# Altium project nrf7002_qfaa.PrjPCB
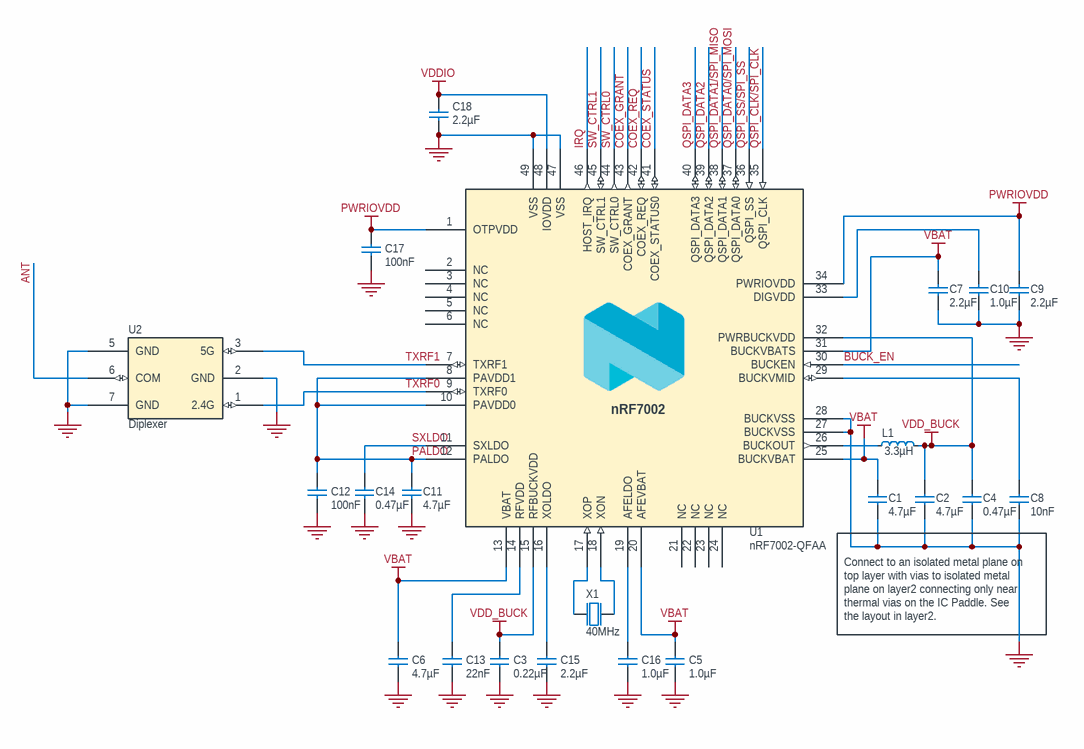
[diagram p0: nrf7002_qfaa.SchDoc]
Classification: PUBLIC; Device: nRF7002; RefLayoutTitle: nRF7002 Reference Layout; Revision: 1.1
1 sheet, 22 parts. Net scope: global (net labels, ports and power ports of the same name join across sheets).
Board file: nrf7002_qfaa.PcbDoc

## Sheet nrf7002_qfaa.SchDoc
size A4; PCAName: nRF7002 Reference Layout; BoardTitle: nRF7002 Reference Layout; Organization: Nordic Semiconductor; Revision: 1.1; SheetNumber: 1; SheetTotal: 1; DrawnBy: PRBU; DocumentSize: A4; RefLayoutTitle: nRF7002 Reference Layout; ProjectName: nrf7002_qfaa.PrjPCB

### Parts
C1  4.7µF  [CAPC1608X06L]
C2  4.7µF  [CAPC1608X06L]
C3  0.22µF  [CAPC0603X03L_C]
C4  0.47µF  [CAPC0603X03L_C]
C5  1.0µF  [CAPC1005X04L]
C6  4.7µF  [CAPC1608X06L]
C7  2.2µF  [CAPC1608X06L]
C8  10nF  [CAPC0603X03L_C]
C9  2.2µF  [CAPC1005X04L]
C10  1.0µF  [CAPC1005X04L]
C11  4.7µF  [CAPC1608X06L]
C12  100nF  [CAPC0603X03L_C]
C13  22nF  [CAPC0603X03L_C]
C14  0.47µF  [CAPC0603X03L_C]
C15  2.2µF  [CAPC0603X03L_C]
C16  1.0µF  [CAPC1005X04L]
C17  100nF  [CAPC0603X03L_C]
C18  2.2µF  [CAPC1608X06L]
L1  3.3µH  [INDC2520X10N]
U1  nRF7002-QFAA  [QFN40P600X600X60-48N]
U2  Diplexer  [CAF-50P160X80-6N]
X1  40MHz  [BT-XTAL_1612]

### Nets
GND: C1.1 C2.1 C3.1 C4.1 C5.1 C6.1 C7.1 C8.2 C9.1 C10.2 C11.1 C12.2 C13.1 C14.1 C15.1 C16.1 C17.1 C18.1 U1.27(BUCKVSS) U1.28(BUCKVSS) U1.47(VSS) U1.49(VSS) U2.2(GND) U2.5(GND) U2.7(GND) X1.2(GND) X1.4(GND)
PWRIOVDD: C9.2 C17.2 U1.1(OTPVDD) U1.34(PWRIOVDD)
VBAT: C1.2 C5.2 C6.2 C7.2 U1.13(VBAT) U1.20(AFEVBAT) U1.25(BUCKVBAT) U1.31(BUCKVBATS)
VDD_BUCK: C2.2 C3.2 C4.2 L1.2 U1.15(RFBUCKVDD) U1.32(PWRBUCKVDD)
VDDIO: C18.2 U1.48(IOVDD)
ANT: U2.6(COM)
BUCK_EN: U1.30(BUCKEN)
COEX_GRANT: U1.43(COEX_GRANT)
COEX_REQ: U1.42(COEX_REQ)
COEX_STATUS: U1.41(COEX_STATUS0)
IRQ: U1.46(HOST_IRQ)
PALDO: C11.2 C12.1 U1.8(PAVDD1) U1.10(PAVDD0) U1.12(PALDO)
QSPI_CLK/SPI_CLK: U1.35(QSPI_CLK)
QSPI_DATA0/SPI_MOSI: U1.37(QSPI_DATA0)
QSPI_DATA1/SPI_MISO: U1.38(QSPI_DATA1)
QSPI_DATA2: U1.39(QSPI_DATA2)
QSPI_DATA3: U1.40(QSPI_DATA3)
QSPI_SS/SPI_SS: U1.36(QSPI_SS)
SW_CTRL0: U1.44(SW_CTRL0)
SW_CTRL1: U1.45(SW_CTRL1)
SXLDO: C14.2 U1.11(SXLDO)
TXRF0: U1.9(TXRF0) U2.1(2.4G)
TXRF1: U1.7(TXRF1) U2.3(5G)
NetC8_1: C8.1 U1.29(BUCKVMID)
NetC10_1: C10.1 U1.33(DIGVDD)
NetC13_2: C13.2 U1.14(RFVDD)
NetC15_2: C15.2 U1.16(XOLDO)
NetC16_2: C16.2 U1.19(AFELDO)
NetL1_1: L1.1 U1.26(BUCKOUT)
NetU1_17: U1.17(XOP) X1.3(out)
NetU1_18: U1.18(XON) X1.1(inp)

Not connected (* = marked no-connect by the designer): U1 2(NC) 3(NC) 4(NC) 5(NC) 6(NC) 21(NC) 22(NC) 23(NC) 24(NC)

### Notes on the sheet
- Connect to an isolated metal plane on top layer with vias to isolated metal plane on layer2 connecting only near thermal vias on the IC Paddle. See the layout in layer2.
- Title
- Size
- Date:
- File:
- A4
- Device
- Sheet         of
- Drawn By:
- Revision
- Classification:

### Library data of the parts
C1 C2 C6 C11 = C0603-4µ7-25V-X6S-GRM188C81E475KE11: Capacitor, Ceramic, X6S,±10%, 25V; Pad Count: 2; Part Number: C0603-4µ7-25V-X6S-GRM188C81E475KE11; Value: 4.7µF; Footprint Doc: 0603; Component Class: Capacitors
C3 = C0201-220n-10V-X5R-GRM033R61A224KE90: Capacitor, Ceramic, X5R, ±10%, 10V; Pad Count: 2; Part Number: C0201-220n-10V-X5R-GRM033R61A224KE90; Value: 0.22µF; Footprint Doc: 0201; Component Class: Capacitors
C4 C14 = C0201-470n-6.3V-X5R-GRM033R60J474KE90: Capacitor, Ceramic, X5R,±10%, 6.3V; Pad Count: 2; Part Number: C0201-470n-6.3V-X5R-GRM033R60J474KE90; Value: 0.47µF; Footprint Doc: 0201; Component Class: Capacitors
C5 = C0402-1µ0-35V-X5R-GRM155R6YA105KE11: Capacitor, Ceramic, X5R,±10%, 35V; Pad Count: 2; Part Number: C0402-1µ0-35V-X5R-GRM155R6YA105KE11; Value: 1.0µF; Footprint Doc: 0402; Component Class: Capacitors
C7 C18 = C0603-2µ2-16V-X7S-GRM188C71C225KE11: Capacitor, Ceramic, X7S,±10%, 16V; Pad Count: 2; Part Number: C0603-2µ2-16V-X7S-GRM188C71C225KE11; Value: 2.2µF; Footprint Doc: 0603; Component Class: Capacitors
C8 = C0201-10n-16V-X7R-GRM033R71C103KE14: Capacitor, Ceramic, X7R,±10%, 16V; Pad Count: 2; Part Number: C0201-10n-16V-X7R-GRM033R71C103KE14; Value: 10nF; Footprint Doc: 0201; Component Class: Capacitors
C9 = C0402-2µ2-25V-X5R-GRM155R61E225KE11: Capacitor, Ceramic, X5R,±10%, 25V; Pad Count: 2; Part Number: C0402-2µ2-25V-X5R-GRM155R61E225KE11; Value: 2.2µF; Footprint Doc: 0402; Component Class: Capacitors
C10 = C0402-1µ0-16V-X6S-GRM155C81C105KE11D: Capacitor, Ceramic, X6S,±10%, 16V; Pad Count: 2; Part Number: C0402-1µ0-16V-X6S-GRM155C81C105KE11D; Value: 1.0µF; Component Class: Capacitors; Footprint Doc: 0402
C12 C17 = C0201-100n-16V-X7S-GRM033C71C104KE14: Capacitor, Ceramic, X7S,±10%, 16V; Pad Count: 2; Part Number: C0201-100n-16V-X7S-GRM033C71C104KE14; Value: 100nF; Footprint Doc: 0201; Component Class: Capacitors
C13 = C0201-22n-10V-X5R-GRM033R61A223KE84: Capacitor, Ceramic, X5R,±10%, 10V; Pad Count: 2; Part Number: C0201-22n-10V-X5R-GRM033R61A223KE84; Value: 22nF; Footprint Doc: 0201; Component Class: Capacitors
C15 = C0201-2µ2-10V-X5R-GRM033R61A225KE47: Capacitor, Ceramic, X5R,±10%, 10V; Pad Count: 2; Part Number: C0201-2µ2-10V-X5R-GRM033R61A225KE47; Value: 2.2µF; Footprint Doc: 0201; Component Class: Capacitors
C16 = C0402-1µ0-10V-X7S-GRM155C71A105KE11: Capacitor, Ceramic, X7S,±10%, 10V; Pad Count: 2; Part Number: C0402-1µ0-10V-X7S-GRM155C71A105KE11; Value: 1.0µF; Footprint Doc: 0402; Component Class: Capacitors
L1 = L1008-3µ3-LQM2HPN3R3MGCL: Inductor, 1A, ±20%, 200mOhm; Pad Count: 2; Part Number: L1008-3µ3-LQM2HPN3R3MGCL; Value: 3.3µH; Footprint Doc: 1008; Component Class: Inductors
U1 = nRF7002-QFAAB0: Wi-fi Dual Band Companion chip; Manufacturer: Nordic Semiconductor; Pad Count: 49; Part Number: nRF7002-QFAAB0; Manufacturer Part Number: nRF7002-QFAAB0; Value: nRF7002-QFAA; Footprint Doc: QFN-48; Component Class: Nordic_Devices
U2 = LFD182G45DCJD247: Signal Conditioning 2.4GHz and 5GHz Diplexer; Manufacturer: Murata; Pad Count: 6; Part Number: LFD182G45DCJD247; Component Class: Filters; Manufacturer Part Number: LFD182G45DCJD247; Footprint Doc: CAF; Value: LFD182G45DCJD247
X1 = XTAL_SMD1612_40MHz_8pF: XTAL SMD 1612, 40MHz, Cl=8pF, Total Tol: ±10ppm; Pad Count: 4; Part Number: XTAL_SMD1612_40MHz_8pF; Value: 40MHz; Footprint Doc: XTAL_1612; Component Class: Oscillators